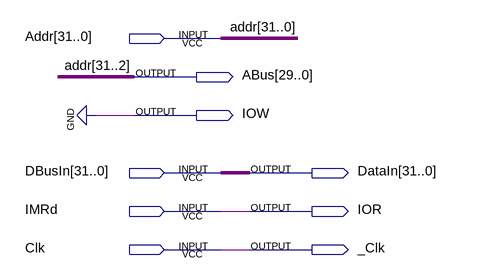
[diagram p0: schematic sheet]
// Quartus schematic IBIU.bdf as structural Verilog: 0 symbols, 9 pins
module IBIU (
  input  [31:0] Addr,
  input  [31:0] DBusIn,
  input  IMRd,
  input  Clk,
  output [29:0] ABus,
  output IOW,
  output [31:0] DataIn,
  output IOR,
  output _Clk
);


  assign _Clk = Clk;
  assign ABus = Addr[31:2];
  assign DataIn = DBusIn;
  assign IOR = IMRd;
  assign IOW = 1'b0;
endmodule
